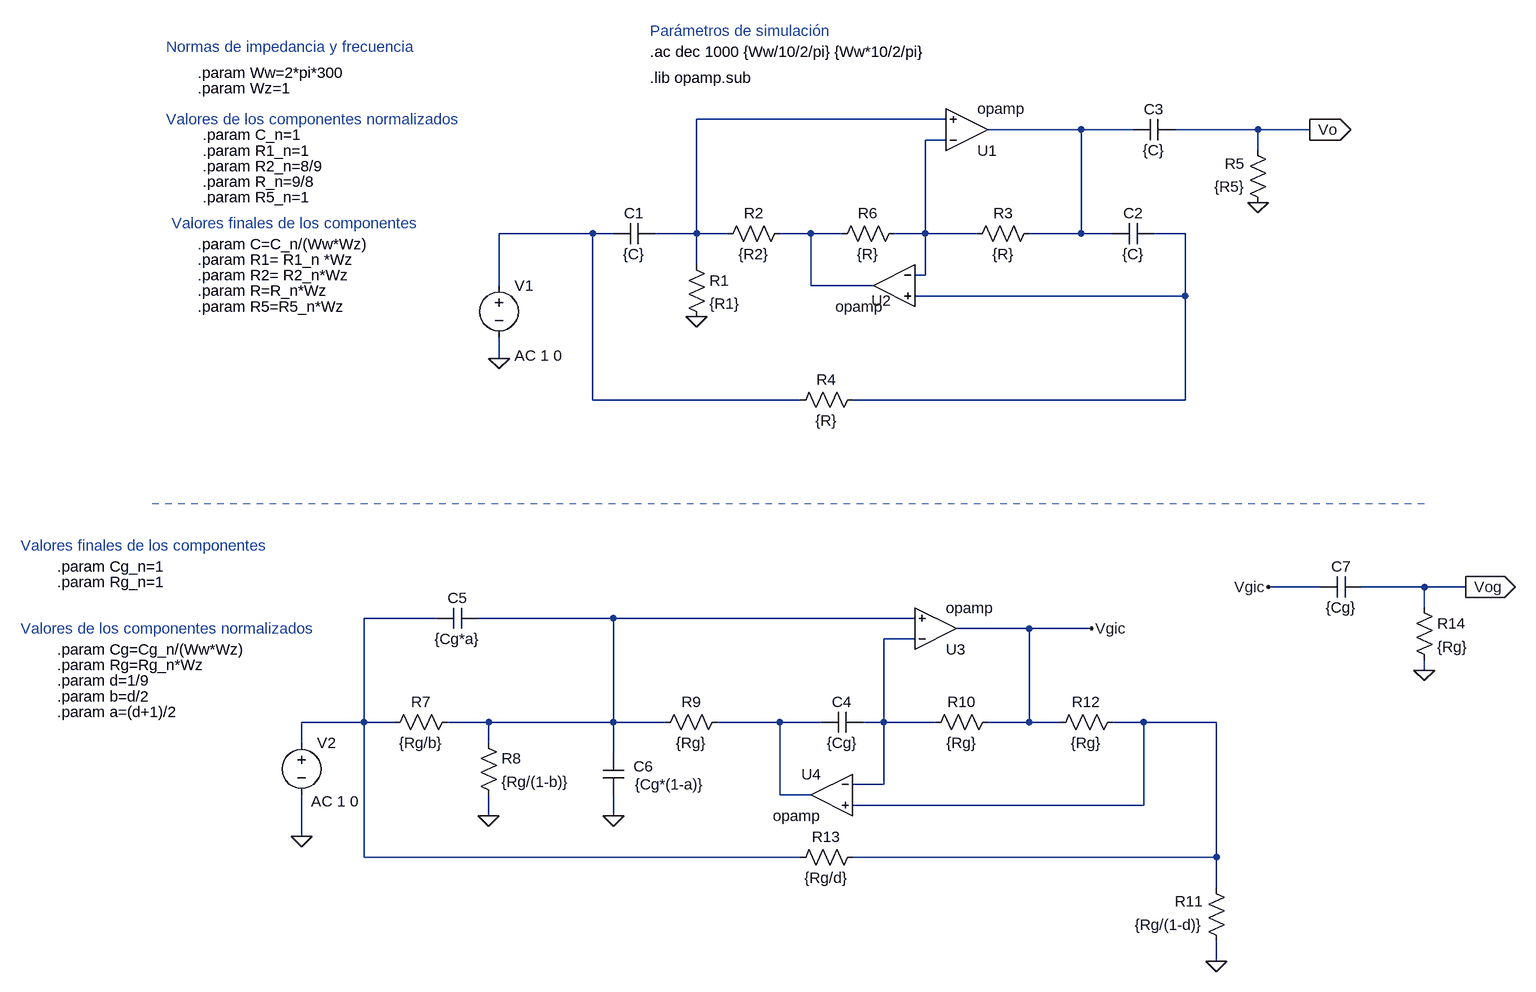
[diagram p0: schematic Circuito_activado.asc]
Circuito_activado.asc, the LTspice schematic file:
Version 4
SHEET 1 1228 1168
WIRE -6048 -160 -6432 -160
WIRE -5840 -144 -5984 -144
WIRE -5760 -144 -5840 -144
WIRE -5568 -144 -5696 -144
WIRE -5488 -144 -5568 -144
WIRE -6048 -128 -6080 -128
WIRE -5568 -112 -5568 -144
WIRE -6592 16 -6736 16
WIRE -6560 16 -6592 16
WIRE -6432 16 -6432 -160
WIRE -6432 16 -6496 16
WIRE -6384 16 -6432 16
WIRE -6256 16 -6304 16
WIRE -6208 16 -6256 16
WIRE -6080 16 -6080 -128
WIRE -6080 16 -6128 16
WIRE -6000 16 -6080 16
WIRE -5840 16 -5840 -144
WIRE -5840 16 -5920 16
WIRE -5792 16 -5840 16
WIRE -5680 16 -5728 16
WIRE -6432 64 -6432 16
WIRE -6080 80 -6080 16
WIRE -6080 80 -6096 80
WIRE -6736 96 -6736 16
WIRE -6256 96 -6256 16
WIRE -6160 96 -6256 96
WIRE -5680 112 -5680 16
WIRE -5680 112 -6096 112
WIRE -6736 208 -6736 176
WIRE -6592 272 -6592 16
WIRE -6272 272 -6592 272
WIRE -5680 272 -5680 112
WIRE -5680 272 -6192 272
WIRE -5472 560 -5552 560
WIRE -5312 560 -5408 560
WIRE -5248 560 -5312 560
WIRE -5312 592 -5312 560
WIRE -6832 608 -6944 608
WIRE -6560 608 -6768 608
WIRE -6096 608 -6560 608
WIRE -5920 624 -6032 624
WIRE -5824 624 -5920 624
WIRE -6096 640 -6144 640
WIRE -5312 688 -5312 672
WIRE -6944 768 -6944 608
WIRE -6944 768 -7040 768
WIRE -6896 768 -6944 768
WIRE -6752 768 -6816 768
WIRE -6560 768 -6560 608
WIRE -6560 768 -6752 768
WIRE -6480 768 -6560 768
WIRE -6304 768 -6400 768
WIRE -6240 768 -6304 768
WIRE -6144 768 -6144 640
WIRE -6144 768 -6176 768
WIRE -6064 768 -6144 768
WIRE -5920 768 -5920 624
WIRE -5920 768 -5984 768
WIRE -5872 768 -5920 768
WIRE -5744 768 -5792 768
WIRE -5632 768 -5744 768
WIRE -7040 800 -7040 768
WIRE -6752 800 -6752 768
WIRE -6560 816 -6560 768
WIRE -6144 864 -6144 768
WIRE -6144 864 -6192 864
WIRE -6304 880 -6304 768
WIRE -6256 880 -6304 880
WIRE -5744 896 -5744 768
WIRE -5744 896 -6192 896
WIRE -6752 912 -6752 880
WIRE -6560 912 -6560 880
WIRE -7040 944 -7040 880
WIRE -6944 976 -6944 768
WIRE -6272 976 -6944 976
WIRE -5632 976 -5632 768
WIRE -5632 976 -6192 976
WIRE -5632 1024 -5632 976
WIRE -5632 1136 -5632 1104
FLAG -5568 -32 0
FLAG -6432 144 0
FLAG -6736 208 0
FLAG -5488 -144 Vo
IOPIN -5488 -144 Out
FLAG -5824 624 Vgic
FLAG -5552 560 Vgic
FLAG -5312 688 0
FLAG -7040 944 0
FLAG -6752 912 0
FLAG -6560 912 0
FLAG -5632 1136 0
FLAG -5248 560 Vog
IOPIN -5248 560 Out
SYMBOL cap -6496 0 R90
WINDOW 0 0 32 VBottom 2
WINDOW 3 32 32 VTop 2
SYMATTR InstName C1
SYMATTR Value {C}
SYMBOL cap -5728 0 R90
WINDOW 0 0 32 VBottom 2
WINDOW 3 32 32 VTop 2
SYMATTR InstName C2
SYMATTR Value {C}
SYMBOL cap -5696 -160 R90
WINDOW 0 0 32 VBottom 2
WINDOW 3 32 32 VTop 2
SYMATTR InstName C3
SYMATTR Value {C}
SYMBOL res -6448 48 R0
SYMATTR InstName R1
SYMATTR Value {R1}
SYMBOL res -6288 0 R90
WINDOW 0 0 56 VBottom 2
WINDOW 3 32 56 VTop 2
SYMATTR InstName R2
SYMATTR Value {R2}
SYMBOL res -5904 0 R90
WINDOW 0 0 56 VBottom 2
WINDOW 3 32 56 VTop 2
SYMATTR InstName R3
SYMATTR Value {R}
SYMBOL res -6176 256 R90
WINDOW 0 0 56 VBottom 2
WINDOW 3 32 56 VTop 2
SYMATTR InstName R4
SYMATTR Value {R}
SYMBOL res -5552 -16 R180
WINDOW 0 36 76 Left 2
WINDOW 3 36 40 Left 2
SYMATTR InstName R5
SYMATTR Value {R5}
SYMBOL voltage -6736 80 R0
WINDOW 123 24 124 Left 2
WINDOW 39 0 0 Left 2
SYMATTR Value2 AC 1 0
SYMATTR InstName V1
SYMATTR Value ""
SYMBOL OpAmps\\opamp -6016 -80 M180
SYMATTR InstName U1
SYMBOL OpAmps\\opamp -6128 32 M0
WINDOW 0 4 87 Left 2
SYMATTR InstName U2
SYMBOL res -6112 0 R90
WINDOW 0 0 56 VBottom 2
WINDOW 3 32 56 VTop 2
SYMATTR InstName R6
SYMATTR Value {R}
SYMBOL res -6800 752 R90
WINDOW 0 0 56 VBottom 2
WINDOW 3 32 56 VTop 2
SYMATTR InstName R7
SYMATTR Value {Rg/b}
SYMBOL res -6768 784 R0
SYMATTR InstName R8
SYMATTR Value {Rg/(1-b)}
SYMBOL res -6384 752 R90
WINDOW 0 0 56 VBottom 2
WINDOW 3 32 56 VTop 2
SYMATTR InstName R9
SYMATTR Value {Rg}
SYMBOL res -5968 752 R90
WINDOW 0 0 56 VBottom 2
WINDOW 3 32 56 VTop 2
SYMATTR InstName R10
SYMATTR Value {Rg}
SYMBOL res -5616 1120 R180
WINDOW 0 36 76 Left 2
WINDOW 3 36 40 Left 2
SYMATTR InstName R11
SYMATTR Value {Rg/(1-d)}
SYMBOL res -5776 752 R90
WINDOW 0 0 56 VBottom 2
WINDOW 3 32 56 VTop 2
SYMATTR InstName R12
SYMATTR Value {Rg}
SYMBOL res -6176 960 R90
WINDOW 0 0 56 VBottom 2
WINDOW 3 32 56 VTop 2
SYMATTR InstName R13
SYMATTR Value {Rg/d}
SYMBOL cap -6176 752 R90
WINDOW 0 0 32 VBottom 2
WINDOW 3 32 32 VTop 2
SYMATTR InstName C4
SYMATTR Value {Cg}
SYMBOL cap -6768 592 R90
WINDOW 0 0 32 VBottom 2
WINDOW 3 32 32 VTop 2
SYMATTR InstName C5
SYMATTR Value {Cg*a}
SYMBOL cap -6544 880 R180
WINDOW 0 -46 44 Left 2
WINDOW 3 -125 16 Left 2
SYMATTR InstName C6
SYMATTR Value {Cg*(1-a)}
SYMBOL OpAmps\\opamp -6064 688 M180
SYMATTR InstName U3
SYMBOL OpAmps\\opamp -6224 816 M0
SYMATTR InstName U4
SYMBOL cap -5408 544 R90
WINDOW 0 0 32 VBottom 2
WINDOW 3 32 32 VTop 2
SYMATTR InstName C7
SYMATTR Value {Cg}
SYMBOL res -5328 576 R0
SYMATTR InstName R14
SYMATTR Value {Rg}
SYMBOL voltage -7040 784 R0
WINDOW 123 15 106 Left 2
WINDOW 39 0 0 Left 2
SYMATTR Value2 AC 1 0
SYMATTR InstName V2
SYMATTR Value ""
TEXT -7200 -232 Left 2 !.param Ww=2*pi*300
TEXT -7200 -208 Left 2 !.param Wz=1
TEXT -7200 32 Left 2 !.param C=C_n/(Ww*Wz)
TEXT -7200 56 Left 2 !.param R1= R1_n *Wz
TEXT -7200 80 Left 2 !.param R2= R2_n*Wz
TEXT -7200 104 Left 2 !.param R=R_n*Wz
TEXT -7200 128 Left 2 !.param R5=R5_n*Wz
TEXT -7192 -136 Left 2 !.param C_n=1
TEXT -7192 -112 Left 2 !.param R1_n=1
TEXT -7192 -88 Left 2 !.param R2_n=8/9
TEXT -7192 -64 Left 2 !.param R_n=9/8
TEXT -7192 -40 Left 2 !.param R5_n=1
TEXT -6504 -224 Left 2 !.lib opamp.sub
TEXT -6504 -264 Left 2 !.ac dec 1000 {Ww/10/2/pi} {Ww*10/2/pi}
TEXT -7248 -272 Left 2 ;Normas de impedancia y frecuencia
TEXT -7248 -160 Left 2 ;Valores de los componentes normalizados
TEXT -7240 0 Left 2 ;Valores finales de los componentes
TEXT -6504 -296 Left 2 ;Parámetros de simulación
TEXT -7416 656 Left 2 !.param Cg=Cg_n/(Ww*Wz)
TEXT -7416 752 Left 2 !.param a=(d+1)/2
TEXT -7416 728 Left 2 !.param b=d/2
TEXT -7416 680 Left 2 !.param Rg=Rg_n*Wz
TEXT -7416 704 Left 2 !.param d=1/9
TEXT -7416 528 Left 2 !.param Cg_n=1
TEXT -7416 552 Left 2 !.param Rg_n=1
TEXT -7472 624 Left 2 ;Valores de los componentes normalizados
TEXT -7472 496 Left 2 ;Valores finales de los componentes
LINE Normal -5312 432 -7280 432 1

The netlist it stands for:
* Circuito_activado.asc
C1 N001 N004 {C}
C2 N006 N002 {C}
C3 Vo N002 {C}
R1 N001 0 {R1}
R2 N005 N001 {R2}
R3 N002 N003 {R}
R4 N006 N004 {R}
R5 0 Vo {R5}
V1 N004 0 AC 1 0
XU1 N003 N001 N002 opamp Aol=100K GBW=10Meg  ; pins invin noninvin out
XU2 N003 N006 N005 opamp Aol=100K GBW=10Meg  ; pins invin noninvin out
R6 N003 N005 {R}
R7 N008 N007 {Rg/b}
R8 N008 0 {Rg/(1-b)}
R9 N010 N008 {Rg}
R10 Vgic N009 {Rg}
R11 0 N011 {Rg/(1-d)}
R12 N011 Vgic {Rg}
R13 N011 N007 {Rg/d}
C4 N009 N010 {Cg}
C5 N008 N007 {Cg*a}
C6 0 N008 {Cg*(1-a)}
XU3 N009 N008 Vgic opamp Aol=100K GBW=10Meg  ; pins invin noninvin out
XU4 N009 N011 N010 opamp Aol=100K GBW=10Meg  ; pins invin noninvin out
C7 Vog Vgic {Cg}
R14 Vog 0 {Rg}
V2 N007 0 AC 1 0
.param Ww=2*pi*300
.param Wz=1
.param C=C_n/(Ww*Wz)
.param R1= R1_n *Wz
.param R2= R2_n*Wz
.param R=R_n*Wz
.param R5=R5_n*Wz
.param C_n=1
.param R1_n=1
.param R2_n=8/9
.param R_n=9/8
.param R5_n=1
.lib opamp.sub
.ac dec 1000 {Ww/10/2/pi} {Ww*10/2/pi}
* Normas de impedancia y frecuencia
* Valores de los componentes normalizados
* Valores finales de los componentes
* Parámetros de simulación
.param Cg=Cg_n/(Ww*Wz)
.param a=(d+1)/2
.param b=d/2
.param Rg=Rg_n*Wz
.param d=1/9
.param Cg_n=1
.param Rg_n=1
* Valores de los componentes normalizados
* Valores finales de los componentes
.backanno
.end